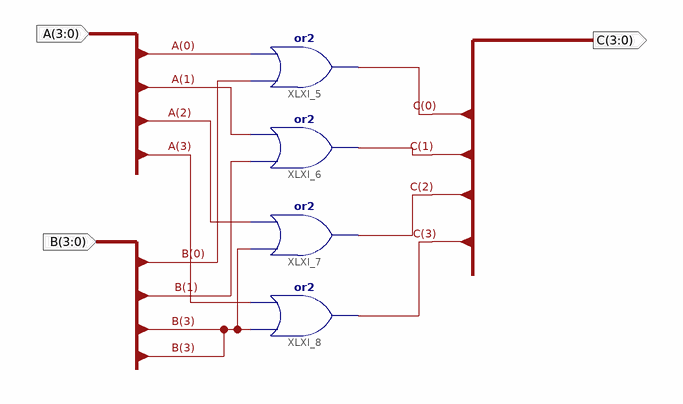
[diagram p0: schematic sheet 1]
// Xilinx ISE schematic myOr2b4.sch (kintex7) as structural Verilog: 4 symbols, 3 ports
module myOr2b4 (
  input  [3:0] A,
  input  [3:0] B,
  output [3:0] C
);

  or XLXI_5 (C[0], B[0], A[0]);
  or XLXI_6 (C[1], B[1], A[1]);
  or XLXI_7 (C[2], B[3], A[2]);
  or XLXI_8 (C[3], B[3], A[3]);
endmodule
